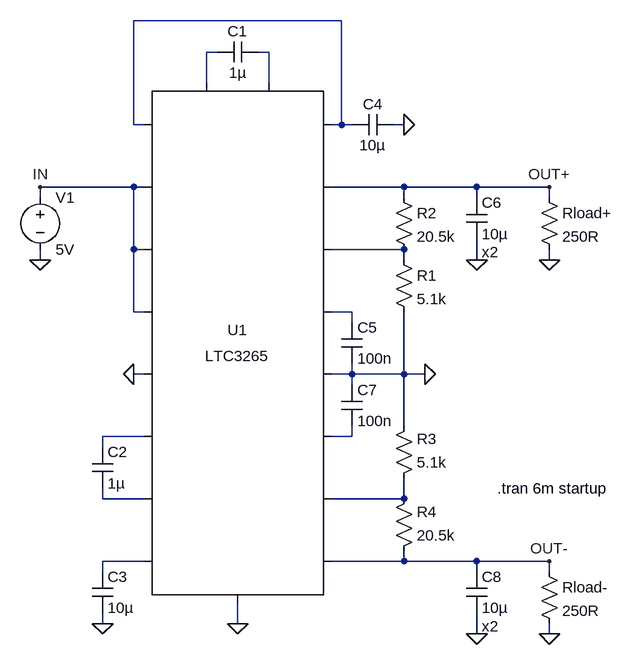
[diagram p0: schematic LTC3265.asc]
LTC3265.asc, the LTspice schematic file:
Version 4
SHEET 1 880 820
WIRE 384 -240 64 -240
WIRE 192 -192 176 -192
WIRE 272 -192 256 -192
WIRE 176 -144 176 -192
WIRE 272 -144 272 -192
WIRE 64 -80 64 -240
WIRE 80 -80 64 -80
WIRE 384 -80 384 -240
WIRE 384 -80 368 -80
WIRE 400 -80 384 -80
WIRE 480 -80 464 -80
WIRE 64 16 -80 16
WIRE 80 16 64 16
WIRE 480 16 368 16
WIRE 592 16 480 16
WIRE 704 16 592 16
WIRE -80 32 -80 16
WIRE 480 32 480 16
WIRE 592 32 592 16
WIRE 704 32 704 16
WIRE 64 112 64 16
WIRE 80 112 64 112
WIRE 480 112 368 112
WIRE -80 128 -80 112
WIRE 480 128 480 112
WIRE 592 128 592 96
WIRE 704 128 704 112
WIRE 64 208 64 112
WIRE 80 208 64 208
WIRE 400 208 368 208
WIRE 400 224 400 208
WIRE 80 304 64 304
WIRE 400 304 400 288
WIRE 400 304 368 304
WIRE 480 304 480 208
WIRE 480 304 400 304
WIRE 512 304 480 304
WIRE 400 320 400 304
WIRE 480 384 480 304
WIRE 80 400 16 400
WIRE 400 400 400 384
WIRE 400 400 368 400
WIRE 16 416 16 400
WIRE 16 496 16 480
WIRE 80 496 16 496
WIRE 480 496 480 464
WIRE 480 496 368 496
WIRE 80 592 16 592
WIRE 480 592 480 576
WIRE 480 592 368 592
WIRE 592 592 480 592
WIRE 704 592 592 592
WIRE 16 608 16 592
WIRE 592 608 592 592
WIRE 704 608 704 592
WIRE 16 688 16 672
WIRE 224 688 224 656
WIRE 592 704 592 672
WIRE 704 704 704 688
FLAG 224 688 0
FLAG -80 128 0
FLAG 64 304 0
FLAG 16 688 0
FLAG 480 -80 0
FLAG 592 128 0
FLAG 592 704 0
FLAG 512 304 0
FLAG 704 128 0
FLAG 704 704 0
FLAG -80 16 IN
FLAG 704 16 OUT+
FLAG 704 592 OUT-
SYMBOL PowerProducts\\LTC3265 224 256 R0
SYMATTR InstName U1
SYMBOL cap 192 -176 R270
WINDOW 0 32 32 VTop 2
WINDOW 3 0 32 VBottom 2
SYMATTR InstName C1
SYMATTR Value 1µ
SYMBOL VOLTAGE -80 16 R0
WINDOW 123 0 0 Left 2
WINDOW 39 0 0 Left 2
SYMATTR InstName V1
SYMATTR Value 5V
SYMBOL cap 0 416 R0
SYMATTR InstName C2
SYMATTR Value 1µ
SYMBOL cap 0 608 R0
SYMATTR InstName C3
SYMATTR Value 10µ
SYMATTR SpiceLine Rser=5m
SYMBOL cap 400 -64 R270
WINDOW 0 32 32 VTop 2
WINDOW 3 0 32 VBottom 2
SYMATTR InstName C4
SYMATTR Value 10µ
SYMATTR SpiceLine Rser=5m
SYMBOL cap 384 224 R0
SYMATTR InstName C5
SYMATTR Value 100n
SYMBOL res 464 112 R0
SYMATTR InstName R1
SYMATTR Value 5.1k
SYMBOL res 464 16 R0
SYMATTR InstName R2
SYMATTR Value 20.5k
SYMBOL cap 576 32 R0
WINDOW 40 24 84 Left 2
SYMATTR InstName C6
SYMATTR Value 10µ
SYMATTR SpiceLine Rser=5m
SYMATTR SpiceLine2 x2
SYMBOL cap 384 384 M180
WINDOW 0 24 56 Left 2
WINDOW 3 24 8 Left 2
SYMATTR InstName C7
SYMATTR Value 100n
SYMBOL res 464 480 M180
WINDOW 0 36 76 Left 2
WINDOW 3 36 40 Left 2
SYMATTR InstName R3
SYMATTR Value 5.1k
SYMBOL res 464 592 M180
WINDOW 0 36 76 Left 2
WINDOW 3 36 40 Left 2
SYMATTR InstName R4
SYMATTR Value 20.5k
SYMBOL cap 576 608 R0
WINDOW 40 24 84 Left 2
SYMATTR InstName C8
SYMATTR Value 10µ
SYMATTR SpiceLine Rser=5m
SYMATTR SpiceLine2 x2
SYMBOL res 688 16 R0
SYMATTR InstName Rload+
SYMATTR Value 250R
SYMBOL res 688 592 R0
SYMATTR InstName Rload-
SYMATTR Value 250R
TEXT 624 480 Left 2 !.tran 6m startup

The netlist it stands for:
* LTC3265.asc
XU1 IN 0 N007 N009 OUT- N010 N008 N006 IN OUT+ IN 0 N004 N005 0 N001 N002 N001 N003 LTC3265
C1 N002 N003 1µ
V1 IN 0 5V
C2 N006 N008 1µ
C3 N010 0 10µ Rser=5m
C4 N001 0 10µ Rser=5m
C5 N005 0 100n
R1 N004 0 5.1k
R2 OUT+ N004 20.5k
C6 OUT+ 0 10µ Rser=5m x2
C7 N007 0 100n
R3 N009 0 5.1k
R4 OUT- N009 20.5k
C8 OUT- 0 10µ Rser=5m x2
Rload+ OUT+ 0 250R
Rload- OUT- 0 250R
.tran 6m startup
.lib LTC3265.sub
.backanno
.end